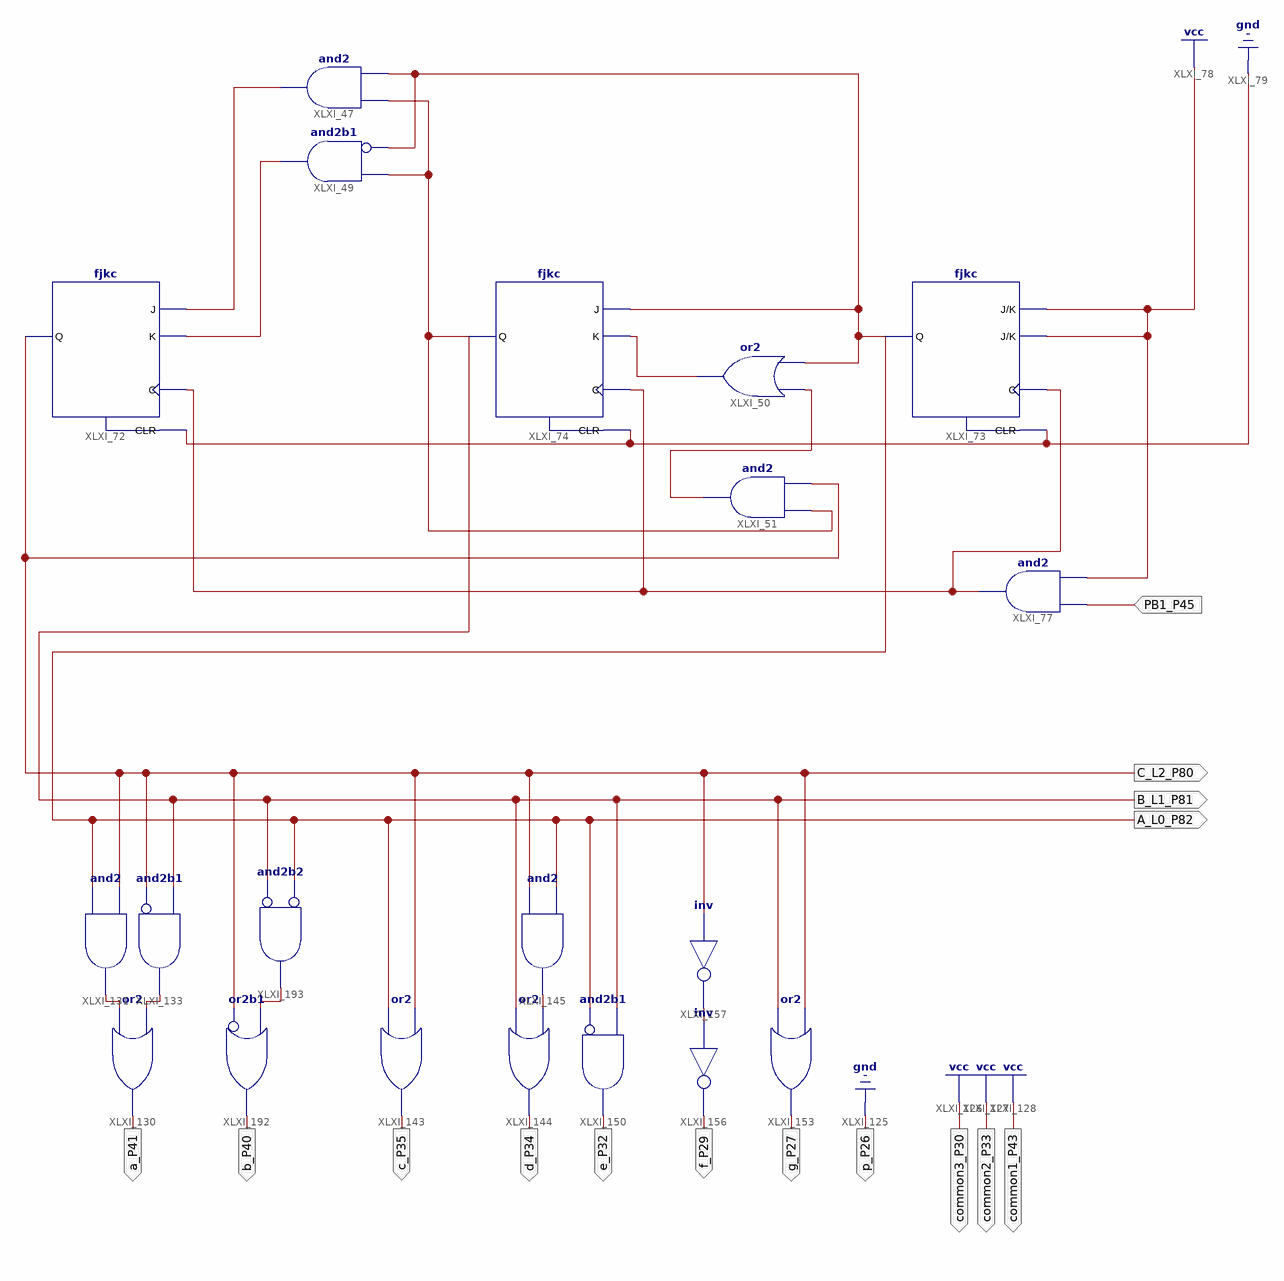
[diagram p0: schematic sheet 1]
// Xilinx ISE schematic JK_CouterUp1_6.sch (spartan6) as structural Verilog: 20 symbols, 15 ports
module JK_CouterUp1_6 (
  input  PB1_P45,
  output A_L0_P82,
  output B_L1_P81,
  output C_L2_P80,
  output a_P41,
  output b_P40,
  output c_P35,
  output d_P34,
  output e_P32,
  output f_P29,
  output g_P27,
  output p_P26,
  output common3_P30,
  output common2_P33,
  output common1_P43
);

  wire XLXN_76, XLXN_79, XLXN_88, XLXN_89, XLXN_138, XLXN_225, XLXN_228, XLXN_239, XLXN_246, XLXN_252;

  and XLXI_47 (XLXN_76, B_L1_P81, A_L0_P82);
  and XLXI_49 (XLXN_79, ~A_L0_P82, B_L1_P81);  // and2b1
  or XLXI_50 (XLXN_89, XLXN_88, A_L0_P82);
  and XLXI_51 (XLXN_88, B_L1_P81, C_L2_P80);
  fjkc XLXI_72 (.C(XLXN_138), .CLR(1'b0), .J(XLXN_76), .K(XLXN_79), .Q(C_L2_P80));
  fjkc XLXI_73 (.C(XLXN_138), .CLR(1'b0), .J(1'b1), .K(1'b1), .Q(A_L0_P82));
  fjkc XLXI_74 (.C(XLXN_138), .CLR(1'b0), .J(A_L0_P82), .K(XLXN_89), .Q(B_L1_P81));
  and XLXI_77 (XLXN_138, PB1_P45, 1'b1);
  or XLXI_130 (a_P41, XLXN_225, XLXN_228);
  and XLXI_131 (XLXN_225, A_L0_P82, C_L2_P80);
  and XLXI_133 (XLXN_228, ~C_L2_P80, B_L1_P81);  // and2b1
  or XLXI_143 (c_P35, A_L0_P82, C_L2_P80);
  or XLXI_144 (d_P34, B_L1_P81, XLXN_246);
  and XLXI_145 (XLXN_246, C_L2_P80, A_L0_P82);
  and XLXI_150 (e_P32, ~A_L0_P82, B_L1_P81);  // and2b1
  or XLXI_153 (g_P27, B_L1_P81, C_L2_P80);
  not XLXI_156 (f_P29, XLXN_252);
  not XLXI_157 (XLXN_252, C_L2_P80);
  or XLXI_192 (b_P40, ~C_L2_P80, XLXN_239);  // or2b1
  and XLXI_193 (XLXN_239, ~B_L1_P81, ~A_L0_P82);  // and2b2

  assign common1_P43 = 1'b1;
  assign common2_P33 = 1'b1;
  assign common3_P30 = 1'b1;
  assign p_P26 = 1'b0;
endmodule
